# Altium schematic sheet Gral.SchDoc
size A4
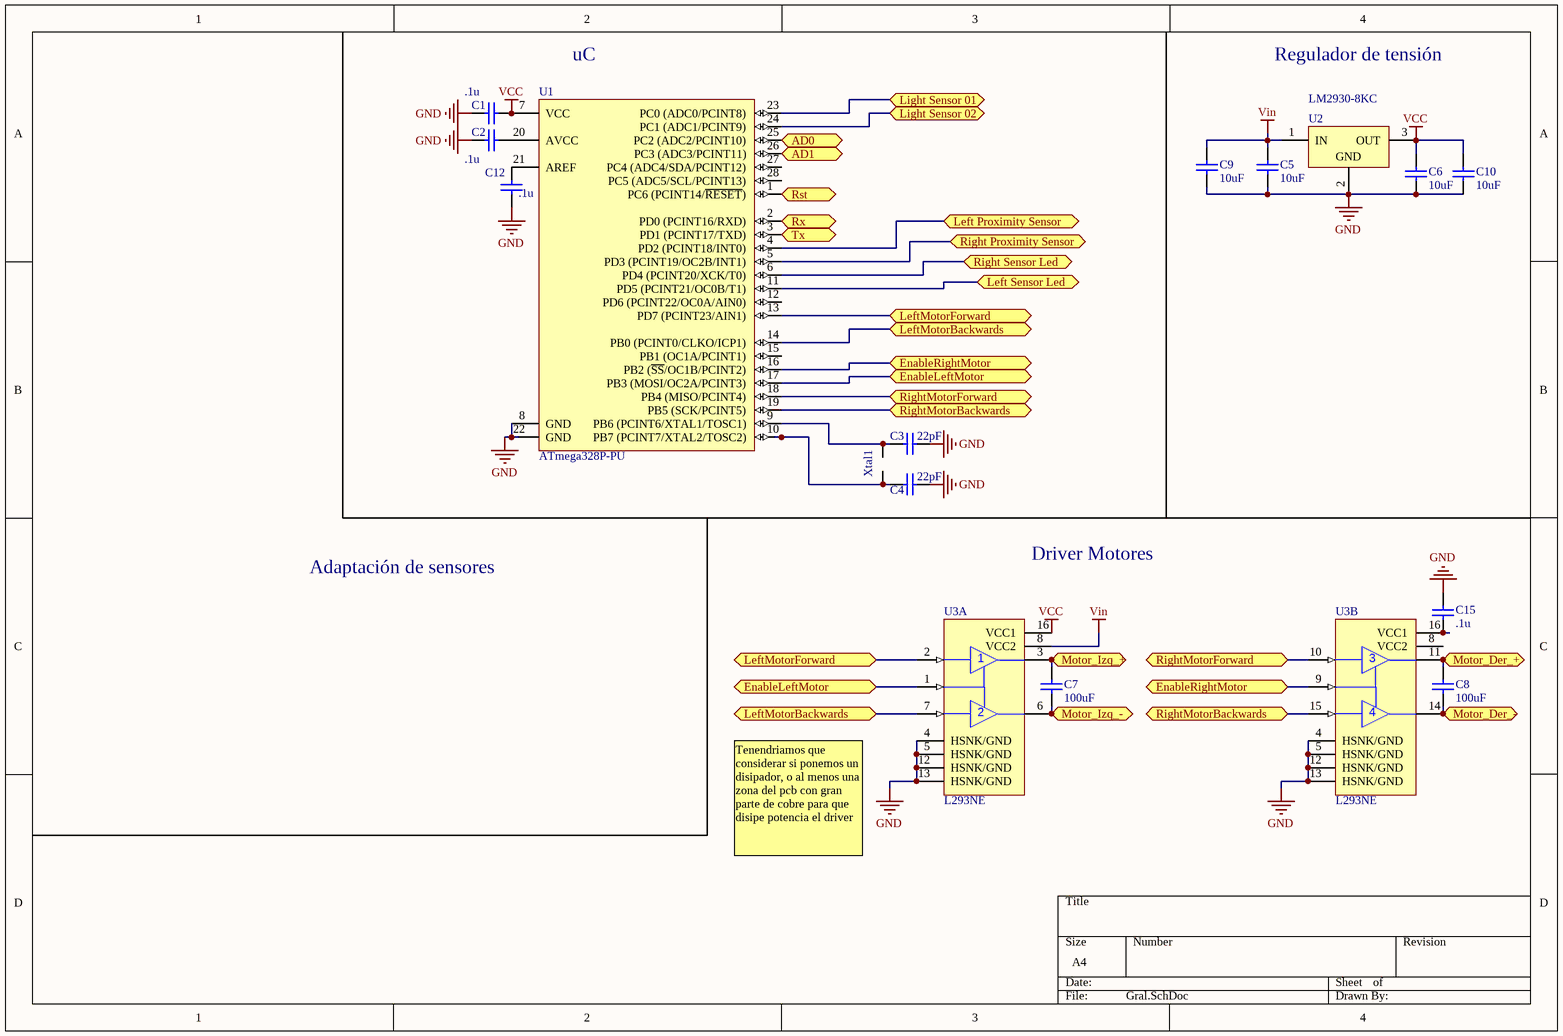
[diagram p0: Gral.SchDoc]

## Parts
C1  value .1u  [RAD-0.3]  (hidden comment: Cap)
C2  value .1u  [RAD-0.3]  (hidden comment: Cap)
C3  value 22pF  [RAD-0.3]  (hidden comment: Cap)
C4  value 22pF  [RAD-0.3]  (hidden comment: Cap)
C5  value 10uF  [RAD-0.3]  (hidden comment: Cap)
C6  value 10uF  [RAD-0.3]  (hidden comment: Cap)
C7  value 100uF  [RAD-0.3]  (hidden comment: Cap)
C8  value 100uF  [RAD-0.3]  (hidden comment: Cap)
C9  value 10uF  [RAD-0.3]  (hidden comment: Cap)
C10  value 10uF  [RAD-0.3]  (hidden comment: Cap)
C12  value .1u  [RAD-0.3]  (hidden comment: Cap)
C15  value .1u  [RAD-0.3]  (hidden comment: Cap)
U1  ATmega328P-PU  [28P3]
U2  LM2930-8KC  [KC03]
U3  L293NE  [NE016]  (parts A,B of 2)
Xtal1  Xtal  [Xtal]  (value not drawn)

## Ports
AD0, AD1, EnableLeftMotor, EnableRightMotor, Left Proximity Sensor, Left Sensor Led, LeftMotorBackwards, LeftMotorForward, Light Sensor 01, Light Sensor 02, Motor_Der_+, Motor_Der_-, Motor_Izq_+, Motor_Izq_-, Right Proximity Sensor, Right Sensor Led, RightMotorBackwards, RightMotorForward, Rst, Rx, Tx

## Nets
GND: C1.1 C2.1 C3.2 C4.2 C5.1 C6.1 C9.1 C10.1 C12.1 C15.1 U1.8(GND) U1.22(GND) U2.2(GND) U3.4(HSNK/GND) U3.5(HSNK/GND) U3.12(HSNK/GND) U3.13(HSNK/GND)
VCC: C1.2 C6.2 C10.2 U1.7(VCC) U2.3(OUT) U3.16(VCC1)
Vin: C5.2 C9.2 U2.1(IN) U3.8(VCC2)
AD0: U1.25(PC2_(ADC2/PCINT10)) ; port AD0
AD1: U1.26(PC3_(ADC3/PCINT11)) ; port AD1
EnableLeftMotor: U1.17(PB3_(MOSI/OC2A/PCINT3)) U3.1(1,2EN) ; port EnableLeftMotor
EnableRightMotor: U1.16(PB2_(~{SS}/OC1B/PCINT2)) U3.9(3,4EN) ; port EnableRightMotor
Left Proximity Sensor: U1.4(PD2_(PCINT18/INT0)) ; port Left Proximity Sensor
Left Sensor Led: U1.11(PD5_(PCINT21/OC0B/T1)) ; port Left Sensor Led
LeftMotorBackwards: U1.14(PB0_(PCINT0/CLKO/ICP1)) U3.7(2A) ; port LeftMotorBackwards
LeftMotorForward: U1.13(PD7_(PCINT23/AIN1)) U3.2(1A) ; port LeftMotorForward
Light Sensor 01: U1.23(PC0_(ADC0/PCINT8)) ; port Light Sensor 01
Light Sensor 02: U1.24(PC1_(ADC1/PCINT9)) ; port Light Sensor 02
Motor_Der_+: C8.2 U3.11(3Y) ; port Motor_Der_+
Motor_Der_-: C8.1 U3.14(4Y) ; port Motor_Der_-
Motor_Izq_+: C7.2 U3.3(1Y) ; port Motor_Izq_+
Motor_Izq_-: C7.1 U3.6(2Y) ; port Motor_Izq_-
Right Proximity Sensor: U1.5(PD3_(PCINT19/OC2B/INT1)) ; port Right Proximity Sensor
Right Sensor Led: U1.6(PD4_(PCINT20/XCK/T0)) ; port Right Sensor Led
RightMotorBackwards: U1.19(PB5_(SCK/PCINT5)) U3.15(4A) ; port RightMotorBackwards
RightMotorForward: U1.18(PB4_(MISO/PCINT4)) U3.10(3A) ; port RightMotorForward
Rst: U1.1(PC6_(PCINT14/~{RESET})) ; port Rst
Rx: U1.2(PD0_(PCINT16/RXD)) ; port Rx
Tx: U1.3(PD1_(PCINT17/TXD)) ; port Tx
NetC2_2: C2.2 U1.20(AVCC)
NetC3_1: C3.1 U1.9(PB6_(PCINT6/XTAL1/TOSC1)) Xtal1.2
NetC4_1: C4.1 U1.10(PB7_(PCINT7/XTAL2/TOSC2)) Xtal1.1
NetC12_2: C12.2 U1.21(AREF)
NetC15_2: C15.2 U3.16(VCC1)

Not connected (* = marked no-connect by the designer): U1 12(PD6_(PCINT22/OC0A/AIN0)) 15(PB1_(OC1A/PCINT1)) 27(PC4_(ADC4/SDA/PCINT12)) 28(PC5_(ADC5/SCL/PCINT13))

## Notes on the sheet
- (near U1) uC
- Regulador de tensión
- Adaptación de sensores
- Driver Motores
- Tenendriamos que considerar si ponemos un disipador, o al menos una zona del pcb con gran parte de cobre para que disipe potencia el driver

## Library data of the parts
C1-C10 C12 C15 = Cap: Capacitor; Published: 8-Jun-2000; LatestRevisionDate: 17-Jul-2002; LatestRevisionNote: Re-released for DXP Platform.; PackageReference: RAD-0.3; Publisher: Altium Limited; PackageDescription: Radial Cap, Thru-Hole; 2 Leads; 0.3 in Pin Spacing
U1 = ATmega328P-PU: 8-bit AVR Microcontroller, 32KB Flash, 1KB EEPROM, 2KB SRAM, 28-pin PDIP, Industrial Grade (-40°C to 85°C); Published: 1-Apr-2010; DatasheetVersion: revA, Jan-2010; PackageVersion: revB, Sep-2001; PackageReference: 28P3; Publisher: Altium Limited; PackageDescription: 28-lead (0.300"/7.62mm Wide) Plastic Dual Inline Package (PDIP); Supplier 1: Digi-Key; Supplier Part Number 1: ATMEGA328P-PU-ND; Supplier 2: Farnell; Supplier Part Number 2: 1715487; Supplier 3: Mouser; Supplier Part Number 3: 556-ATMEGA328P-PU; ComponentLink1Description: Manufacturer Link; ComponentLink1URL: http://www.atmel.com/products/avr/default.asp?; ComponentLink2Description: ATmega48A/48PA/88A/88PA/168A/168PA/328/328P Datasheet; ComponentLink2URL: http://www.atmel.com/dyn/resources/prod_documents/8271.pdf; ComponentLink3Description: ATmega48A/48PA/88A/88PA/168A/168PA/328/328P Summary; ComponentLink3URL: http://www.atmel.com/dyn/resources/prod_documents/8271S.pdf; ComponentLink4Description: Atmel.com Home; ComponentLink4URL: http://www.atmel.com
U2 = LM2930-8KC: 3-Terminal Positive Regulator; Note: Pin 2 is electrically connected to tab; Published: 15-Apr-2002; DatasheetVersion: Jun-1988; PackageVersion: Sep-1995; PackageReference: KC03; Publisher: Altium Limited; PackageDescription: TO, Thru-Hole, Vertical, Heatsink Mounted; 3 In-Line Leads; Pitch 2.54 mm; ComponentLink1Description: Manufacturer Link; ComponentLink1URL: http://www.ti.com/
U3 = L293NE: Quadruple Half-H Driver; Published: 15-May-2002; LatestRevisionDate: 29-May-2009; LatestRevisionNote: Component Body Added.; DatasheetVersion: May-1990; PackageVersion: 1991; PackageReference: NE016; Publisher: Altium Limited; PackageDescription: DIP, 16-Pin, Row Spacing 7.62 mm, Pitch 2.54 mm; Code_JEDEC: MS-001-BB; ComponentLink1Description: Manufacturer Link; ComponentLink1URL: http://www.ti.com/; ComponentLink2Description: Datasheet; ComponentLink2URL: http://www-s.ti.com/sc/ds/l293.pdf